# EAGLE design uc2950 (EAGLE 8.3.2)
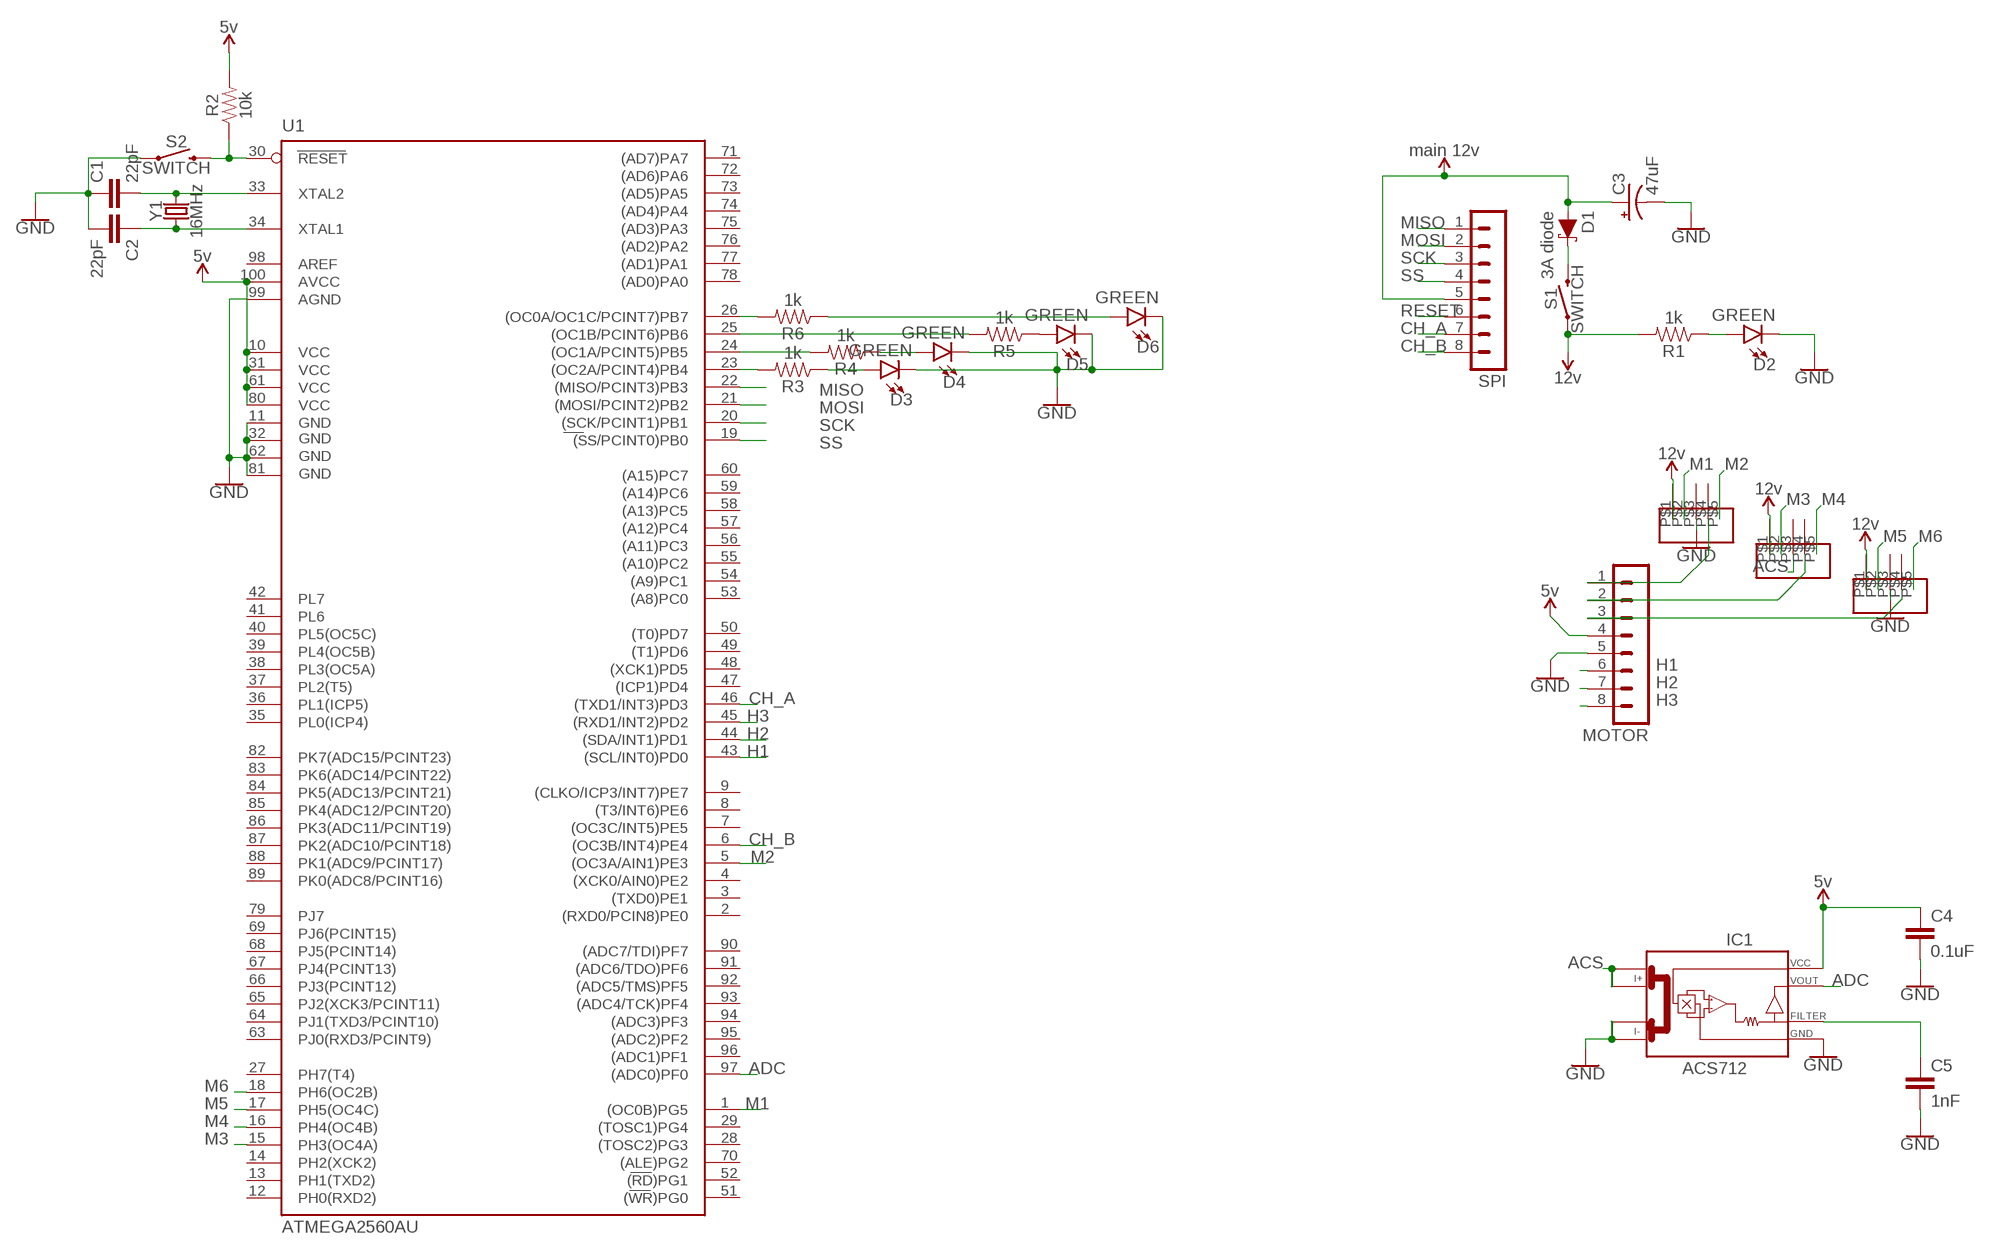
[diagram p0: schematic, sheet 1]

## Parts
C1  22pF  22PF-0603-50V-5%  [0603]
C2  22pF  22PF-0603-50V-5%  [0603]
C3  47uF  47UF-POLAR-EIA3528-10V-10%  [EIA3528]
C4  0.1uF  0.1UF-0603-25V-(+80/-20%)  [0603]
C5  1nF  1.0NF/1000PF-0603-50V-10%  [0603]
D1  3A diode  DIODE-SCHOTTKY-B340A  [SMA-DIODE]
D2  GREEN  LED-GREEN0603  [LED-0603]
D3  GREEN  LED-GREEN0603  [LED-0603]
D4  GREEN  LED-GREEN0603  [LED-0603]
D5  GREEN  LED-GREEN0603  [LED-0603]
D6  GREEN  LED-GREEN0603  [LED-0603]
IC1  ACS712  [SO08]
M1  M1  UC2950  [UC2950]
M2  M2  UC2950  [UC2950]
M3  M3  UC2950  [UC2950]
MOTOR  MA08-1  [MA08-1]
R1  1k  1KOHM-0603-1/10W-1%  [0603]
R2  10k  10KOHM-0603-1/10W-1%  [0603]
R3  1k  1KOHM-0603-1/10W-1%  [0603]
R4  1k  1KOHM-0603-1/10W-1%  [0603]
R5  1k  1KOHM-0603-1/10W-1%  [0603]
R6  1k  1KOHM-0603-1/10W-1%  [0603]
S1  SWITCH  MOMENTARY-SWITCH-SPST-SMD-4.6X2.8MM  [TACTILE_SWITCH_SMD_4.6X2.8MM]
S2  SWITCH  MOMENTARY-SWITCH-SPST-SMD-4.6X2.8MM  [TACTILE_SWITCH_SMD_4.6X2.8MM]
SPI  MA08-1  [MA08-1]
U1  ATMEGA2560AU  [TQFP100]
Y1  16MHz  CRYSTAL-16MHZSMD-5X3.2  [CRYSTAL-SMD-5X3.2-4PAD]

## Nets
ACS: IC1.1(I+_0) IC1.2(I+_1) M2.P$3
ADC: IC1.7(VOUT) U1.97((ADC0)PF0)
CH_A: SPI.7 U1.46((TXD1/INT3)PD3)
CH_B: SPI.8 U1.6((OC3B/INT4)PE4)
GND: C1.1 C2.2 C3.C(-) C4.2 C5.2 D2.C D3.C D4.C D5.C D6.C IC1.3(I-_0) IC1.4(I-_1) IC1.5(GND) M1.P$3 M3.P$3 MOTOR.5 S2.1 S2.2 U1.11(GND) U1.32(GND1) U1.62(GND2) U1.81(GND3) U1.99(AGND)
H1: MOTOR.6 U1.43((SCL/INT0)PD0)
H2: MOTOR.7 U1.44((SDA/INT1)PD1)
H3: MOTOR.8 U1.45((RXD1/INT2)PD2)
M1: M1.P$2 U1.1((OC0B)PG5)
M2: M1.P$5 U1.5((OC3A/AIN1)PE3)
M3: M2.P$2 U1.15(PH3(OC4A))
M4: M2.P$5 U1.16(PH4(OC4B))
M5: M3.P$2 U1.17(PH5(OC4C))
M6: M3.P$5 U1.18(PH6(OC2B))
MISO: SPI.1 U1.22((MISO/PCINT3)PB3)
MOSI: SPI.2 U1.21((MOSI/PCINT2)PB2)
N$1: D1.C S1.3 S1.4
N$3: D2.A R1.1
N$4: M1.P$4 MOTOR.1
N$5: M3.P$4 MOTOR.3
N$6: M2.P$4 MOTOR.2
N$10: C5.1 IC1.6(FILTER)
N$15: C1.2 U1.33(XTAL2) Y1.3
N$16: C2.1 U1.34(XTAL1) Y1.1
N$17: R4.2 U1.24((OC1A/PCINT5)PB5)
N$19: D3.A R3.1
N$20: D4.A R4.1
N$21: D5.A R5.1
N$22: D6.A R6.1
N$23: R3.2 U1.23((OC2A/PCINT4)PB4)
N$24: R5.2 U1.25((OC1B/PCINT6)PB6)
N$25: R6.2 U1.26((OC0A/OC1C/PCINT7)PB7)
RESET: R2.1 S2.3 S2.4 SPI.6 U1.30(RESET)
SCK: SPI.3 U1.20((SCK/PCINT1)PB1)
SS: SPI.4 U1.19((SS/PCINT0)PB0)
VCC_1: C3.A(+) D1.A SPI.5 ; supply symbol labelled main 12v
VCC_2: M1.P$1 M2.P$1 M3.P$1 R1.2 S1.1 S1.2 ; supply symbol labelled 12v
VCCIO: C4.1 IC1.8(VCC) MOTOR.4 R2.2 U1.10(VCC) U1.31(VCC1) U1.61(VCC2) U1.80(VCC3) U1.100(AVCC) ; supply symbol labelled 5v
Unconnected: U1.2((RXD0/PCIN8)PE0) U1.3((TXD0)PE1) U1.4((XCK0/AIN0)PE2) U1.7((OC3C/INT5)PE5) U1.8((T3/INT6)PE6) U1.9((CLKO/ICP3/INT7)PE7) U1.12(PH0(RXD2)) U1.13(PH1(TXD2)) U1.14(PH2(XCK2)) U1.27(PH7(T4)) U1.28((TOSC2)PG3) U1.29((TOSC1)PG4) U1.35(PL0(ICP4)) U1.36(PL1(ICP5)) U1.37(PL2(T5)) U1.38(PL3(OC5A)) U1.39(PL4(OC5B)) U1.40(PL5(OC5C)) U1.41(PL6) U1.42(PL7) U1.47((ICP1)PD4) U1.48((XCK1)PD5) U1.49((T1)PD6) U1.50((T0)PD7) U1.51((WR)PG0) U1.52((RD)PG1) U1.53((A8)PC0) U1.54((A9)PC1) U1.55((A10)PC2) U1.56((A11)PC3) U1.57((A12)PC4) U1.58((A13)PC5) U1.59((A14)PC6) U1.60((A15)PC7) U1.63(PJ0(RXD3/PCINT9)) U1.64(PJ1(TXD3/PCINT10)) U1.65(PJ2(XCK3/PCINT11)) U1.66(PJ3(PCINT12)) U1.67(PJ4(PCINT13)) U1.68(PJ5(PCINT14)) U1.69(PJ6(PCINT15)) U1.70((ALE)PG2) U1.71((AD7)PA7) U1.72((AD6)PA6) U1.73((AD5)PA5) U1.74((AD4)PA4) U1.75((AD3)PA3) U1.76((AD2)PA2) U1.77((AD1)PA1) U1.78((AD0)PA0) U1.79(PJ7) U1.82(PK7(ADC15/PCINT23)) U1.83(PK6(ADC14/PCINT22)) U1.84(PK5(ADC13/PCINT21)) U1.85(PK4(ADC12/PCINT20)) U1.86(PK3(ADC11/PCINT19)) U1.87(PK2(ADC10/PCINT18)) U1.88(PK1(ADC9/PCINT17)) U1.89(PK0(ADC8/PCINT16)) U1.90((ADC7/TDI)PF7) U1.91((ADC6/TDO)PF6) U1.92((ADC5/TMS)PF5) U1.93((ADC4/TCK)PF4) U1.94((ADC3)PF3) U1.95((ADC2)PF2) U1.96((ADC1)PF1) U1.98(AREF)

## Library data of the parts
C1 C2 = SparkFun-Capacitors:22PF: 22pF ceramic capacitors A capacitor is a passive two-terminal electrical component used to store electrical energy temporarily in an electric field.; PROD_ID: CAP-07876
C3 = SparkFun-Capacitors:47UF-POLAR: 47µF polarized capacitors A capacitor is a passive two-terminal electrical component used to store electrical energy temporarily in an electric field.; PROD_ID: CAP-08310
C4 = SparkFun-Capacitors:0.1UF: 0.1µF ceramic capacitors A capacitor is a passive two-terminal electrical component used to store electrical energy temporarily in an electric field.; PROD_ID: CAP-00810
C5 = SparkFun-Capacitors:1.0NF/1000PF: 1nF/1,000pF ceramic capacitors A capacitor is a passive two-terminal electrical component used to store electrical energy temporarily in an electric field.; PROD_ID: CAP-07886
D1 = SparkFun-DiscreteSemi:DIODE-SCHOTTKY: Schottky diode A Schottky diode is a semiconductor diode which has a low forward voltage drop and a very fast switching action.; PROD_ID: DIO-09886; VALUE: 3A/40V/500mV
D2-D6 = SparkFun-LED:LED-GREEN: Green SMD LED Used in manufacturing of various products at SparkFun Packages: 0603 - SMD 0603 package [Product Link] <http://www.futureelectronics.com/en/technologies/semiconductors/optoelectronics/leds/Pages/9894312-LTST-C190GKT.aspx?CrossPart=HSMG-C190&IM=0> LilyPad 1206 - SMD1206 LilyPad package [Product Link] <http://www.futureelectronics.com/en/Technologies/Product.aspx?ProductID=IN150NGHARVATEKCORPORATION2049943&IM=0> 1206 - SMD1206 package [Product Link] <http://www.futureelectronics.com/en/technologies/semiconductors/optoelectronics/leds/Pages/8315665-LTST-C150KGKT.aspx?IM=0> 1206 Bottom Mount -SMD 1206 Bottom Mount [Product Link] <http://www.digikey.com/product-detail/en/lite-on-inc/LTST-C230KGKT/160-1456-1-ND/386854> SparkFun Products: Pro Mini 328 -5V <https://www.sparkfun.com/products/821> RedBoard <https://www.sparkfun.com/products/12757> MP3 Trigger <https://www.sparkfun.com/products/13720> Makey Makey <https://www.sparkfun.com/products/11076>; PROD_ID: DIO-00821
IC1 = ACS712:ACS712
M1-M3 = uc2950:UC2950: UC2950T Motor Driver IC
MOTOR SPI = con-lstb:MA08-1: PIN HEADER; OC_FARNELL: unknown; OC_NEWARK: unknown
R1 R3-R6 = SparkFun-Resistors:1KOHM: 1kΩ resistor A resistor is a passive two-terminal electrical component that implements electrical resistance as a circuit element. Resistors act to reduce current flow, and, at the same time, act to lower voltage levels within circuits. - Wikipedia; PROD_ID: RES-07856
R2 = SparkFun-Resistors:10KOHM: 10kΩ resistor A resistor is a passive two-terminal electrical component that implements electrical resistance as a circuit element. Resistors act to reduce current flow, and, at the same time, act to lower voltage levels within circuits. - Wikipedia; PROD_ID: RES-00824
S1 S2 = SparkFun-Switches:MOMENTARY-SWITCH-SPST: Momentary Switch (Pushbutton) - SPST Normally-open (NO) SPST momentary switches (buttons, pushbuttons). Variants PTH-12MM - 12mm square, through-hole Momentary Pushbutton Switch - 12mm Square <https://www.sparkfun.com/products/9190> (COM-09190) PTH-6.0MM, PTH-6.0MM-KIT - 6.0mm square, through-hole Mini Pushbutton Switch <https://www.sparkfun.com/products/97> (COM-00097) KIT package intended for soldering kit's - only one side of pads' copper is exposed. PTH-RIGHT-ANGLE-KIT - Right-angle, through-hole Right Angle Tactile Button <https://www.sparkfun.com/products/10791> - Used on SparkFun BigTime Watch Kit <https://www.sparkfun.com/products/11734> SMD-12MM - 12mm square, surface-mount Tactile Button - SMD (12mm) <https://www.sparkfun.com/products/12993> (COM-12993) Used on SparkFun PicoBoard <https://www.sparkfun.com/products/11888> SMD-4.5MM - 4.5mm Square Trackball Switch Used on SparkFun Blackberry Trackballer Breakout <https://www.sparkfun.com/products/13169> SMD-4.6MMX2.8MM - 4.60mm x 2.80mm, surface mount Used on SparkFun SAMD21 Mini Breakout <https://www.sparkfun.com/products/13664> SMD-5.2MM, SMD-5.2-REDUNDANT - 5.2mm square, surface-mount Mini Pushbutton Switch - SMD <https://www.sparkfun.com/products/8720> (COM-08720) Used on Arduino Pro Mini <https://www.sparkfun.com/products/11114> REDUNDANT package connects both switch circuits together SMD-6.0X3.5MM - 6.0 x 3.5mm, surface mount Momentary Reset Switch SMD <https://www.sparkfun.com/products/8229> (COM-08229) SMD-6.2MM-TALL - 6.2mm square, surface mount Tactile Button - SMD (6mm) <https://www.sparkfun.com/products/12992> Used on SparkFun Digital Sandbox <https://www.sparkfun.com/products/12651> SMD-RIGHT-ANGLE - Right-angle, surface mount Used on SparkFun Block for Intel® Edison - Arduino <https://www.sparkfun.com/products/13036>; PROD_ID: SWCH-13065
U1 = SparkFun-IC-Microcontroller:ATMEGA2560: Atmel 100-pin 8-bit uC 64/128/256 Kbytes FLASH 4 Kbytes EEPROM 8 Kbytes SRAM 86 General Purpose I/O pins 12-channels16-bit PWM 4 x Serial USARTs 16-channels 10-bit A/D SparkFun Products None.; PROD_ID: IC-10040
Y1 = SparkFun-Clocks:CRYSTAL-16MHZ: 16MHz Crystal Digikey Example <http://www.digikey.com/product-search/en?keywords=535-9122-1-ND> Frequency: 16MHz Frequency Stability: ±50ppm Frequency Tolerance: ±20ppm Load Capacitance: 18pF SparkFun Products: Pro Micro -5V/16MHz <https://www.sparkfun.com/products/12640> SparkFun Serial Enabled LCD Kit <https://www.sparkfun.com/products/10097>; PROD_ID: XTAL-08218; SF_ID: COM-00094

## Board
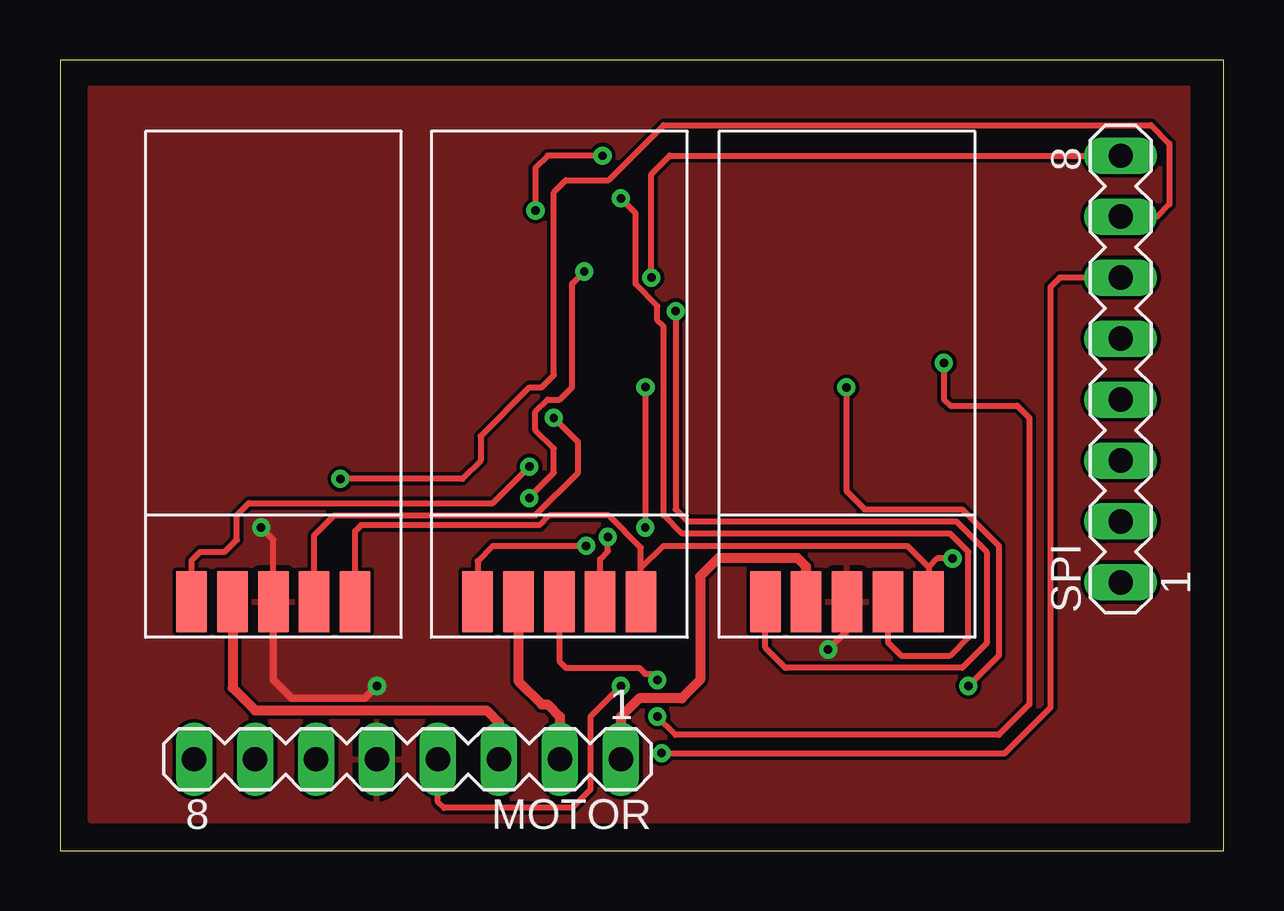
[diagram p1: board, top side]
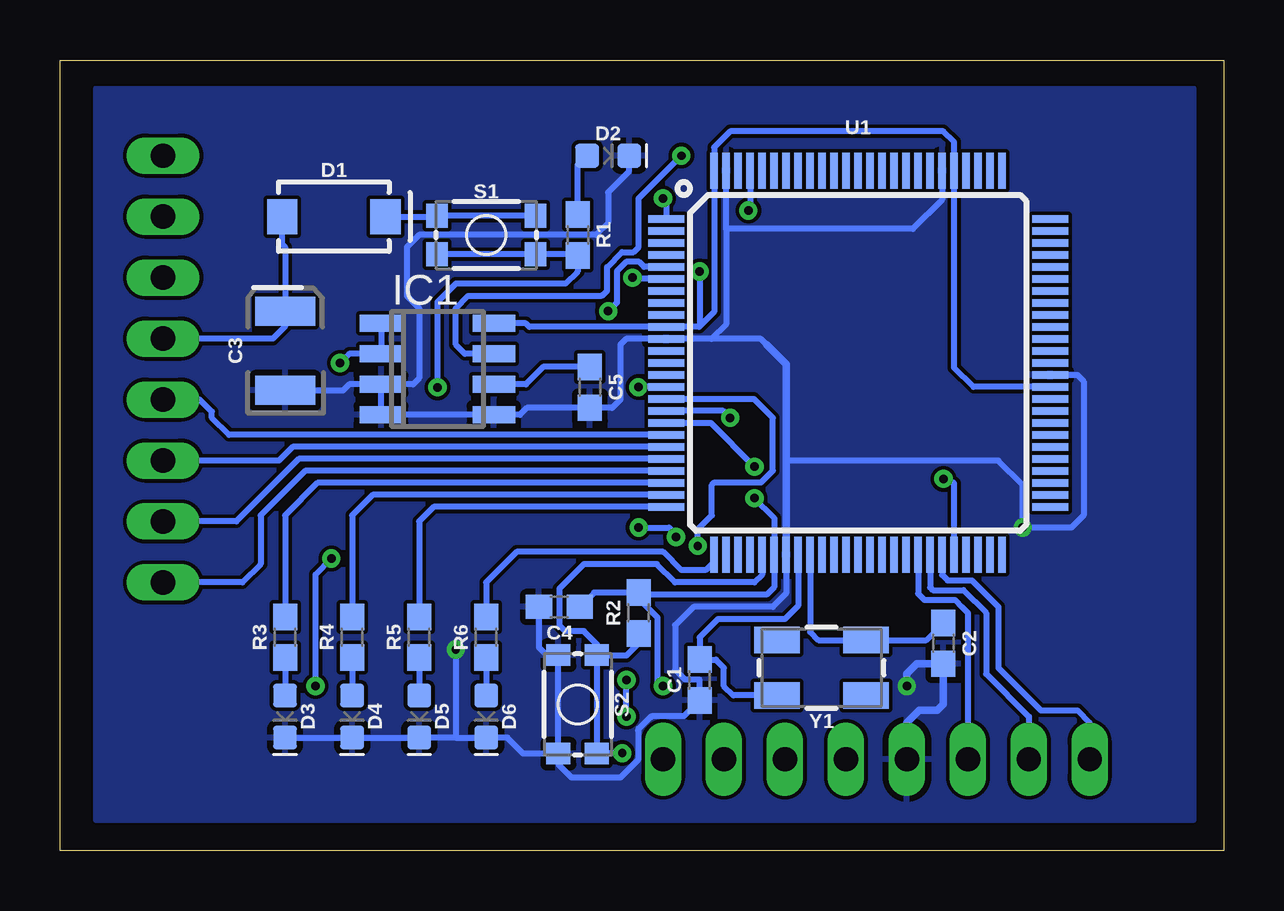
[diagram p2: board, bottom side, seen from below]

Size 48.49 x 32.94 mm. Coordinates in mm from the lower left corner, seen from the top.
Outline: 0,0 48.49,0 48.49,32.94 0,32.94 0,0
Copper layers (1*16): Top 0.035mm / dielectric 1.5mm / Bottom 0.035mm
Design rules "default": minimum track width 6mil, minimum drill 0.35mm, track to track 6mil, track to pad 6mil, pad to pad 6mil, via to via 6mil, smd to smd 6mil, copper to edge 40mil, drill to drill 6mil, minimum pad ring 10mil, minimum via ring 8mil, stop-mask expansion 4mil, vias tented up to drill 0mil, thermal gap 10mil

### Footprints (pad centres in the part's own frame; a part is rotated, then mirrored left to right if it is on the bottom)
0603 = smd 1.1 x 1: 1 -0.85,0; 2 0.85,0
EIA3528 = smd 1.2 x 2.5: A 1.65,0; C -1.65,0
SMA-DIODE = smd 1.27 x 1.47: A -2.15,0; C 2.15,0
LED-0603 = smd 1 x 1: A -0.877,0; C 0.877,0
SO08 = smd 0.72 x 1.78: 1 -1.905,-2.35; 2 -0.635,-2.35; 3 0.635,-2.35; 4 1.905,-2.35; 5 1.905,2.35; 6 0.635,2.35; 7 -0.635,2.35; 8 -1.905,2.35
UC2950 = smd 1.27 x 2.54: P$1 1.93,3.607; P$2 3.632,3.607; P$3 5.334,3.607; P$4 7.036,3.607; P$5 8.738,3.607
MA08-1 = drill 1.016 long: 1 -8.89,0; 2 -6.35,0; 3 -3.81,0; 4 -1.27,0; 5 1.27,0; 6 3.81,0; 7 6.35,0; 8 8.89,0
TACTILE_SWITCH_SMD_4.6X2.8MM = smd 0.9 x 1: 1 -2.05,-0.8; 2 2.05,-0.8; 3 2.05,0.8; 4 -2.05,0.8
TQFP100 = smd 1.5 x 0.3: 1 -8,6; 2 -8,5.5; 3 -8,5; 4 -8,4.5; 5 -8,4; 6 -8,3.5; 7 -8,3; 8 -8,2.5; 9 -8,2; 10 -8,1.5; 11 -8,1; 12 -8,0.5; 13 -8,0; 14 -8,-0.5; 15 -8,-1; 16 -8,-1.5; 17 -8,-2; 18 -8,-2.5; 19 -8,-3; 20 -8,-3.5; 21 -8,-4; 22 -8,-4.5; 23 -8,-5; 24 -8,-5.5; 25 -8,-6; 51 8,-6; 52 8,-5.5; 53 8,-5; 54 8,-4.5; 55 8,-4; 56 8,-3.5; 57 8,-3; 58 8,-2.5; 59 8,-2; 60 8,-1.5; 61 8,-1; 62 8,-0.5; 63 8,0; 64 8,0.5; 65 8,1; 66 8,1.5; 67 8,2; 68 8,2.5; 69 8,3; 70 8,3.5; 71 8,4; 72 8,4.5; 73 8,5; 74 8,5.5; 75 8,6 | smd 0.3 x 1.5: 26 -6,-8; 27 -5.5,-8; 28 -5,-8; 29 -4.5,-8; 30 -4,-8; 31 -3.5,-8; 32 -3,-8; 33 -2.5,-8; 34 -2,-8; 35 -1.5,-8; 36 -1,-8; 37 -0.5,-8; 38 0,-8; 39 0.5,-8; 40 1,-8; 41 1.5,-8; 42 2,-8; 43 2.5,-8; 44 3,-8; 45 3.5,-8; 46 4,-8; 47 4.5,-8; 48 5,-8; 49 5.5,-8; 50 6,-8; 76 6,8; 77 5.5,8; 78 5,8; 79 4.5,8; 80 4,8; 81 3.5,8; 82 3,8; 83 2.5,8; 84 2,8; 85 1.5,8; 86 1,8; 87 0.5,8; 88 0,8; 89 -0.5,8; 90 -1,8; 91 -1.5,8; 92 -2,8; 93 -2.5,8; 94 -3,8; 95 -3.5,8; 96 -4,8; 97 -4.5,8; 98 -5,8; 99 -5.5,8; 100 -6,8
CRYSTAL-SMD-5X3.2-4PAD = smd 1.9 x 1.1: 1 -1.85,-1.15; 2 1.85,-1.15; 3 1.85,1.15; 4 -1.85,1.15

### Placement (x,y rotation side)
C1  21.84,7.11 90 bottom
C2  11.68,8.64 270 bottom
C3  39.12,20.83 90 bottom
C4  27.69,10.16 180 bottom
C5  26.42,19.3 270 bottom
D1  37.08,26.42 0 bottom
D2  25.65,28.96 0 bottom
D3  39.12,5.59 270 bottom
D4  36.32,5.59 270 bottom
D5  33.53,5.59 270 bottom
D6  30.73,5.59 270 bottom
IC1  32.77,20.07 270 bottom
M1  38.13,13.97 180 top
M2  26.14,13.97 180 top
M3  14.22,13.97 180 top
MOTOR  14.48,3.81 180 top
R1  26.92,25.65 270 bottom
R2  24.38,9.91 90 bottom
R3  39.12,8.89 90 bottom
R4  36.32,8.89 90 bottom
R5  33.53,8.89 90 bottom
R6  30.73,8.89 90 bottom
S1  30.73,25.65 0 bottom
S2  26.92,6.1 270 bottom
SPI  44.2,20.07 90 top
U1  15.24,20.32 0 bottom
Y1  16.76,7.62 180 bottom

### Tracks (layer width: path | path; a pad name or v marks a point on that pad's centre or on a via)
ACS  (via drill 0.35)
  Top 0.254: M2.P$3 20.8,7.9 21.08,7.62 24.13,7.62 24.38,7.37 24.64,7.37 v24.89,7.11 | v36.83,20.32 36.83,18.8 37.08,18.54 39.88,18.54 40.39,18.03 40.39,6.1 39.12,4.83 25.65,4.83 v24.89,5.59
  Bottom 0.254: IC1.1 IC1.2 36.45,20.7 v36.83,20.32 | v24.89,5.59 v24.89,7.11
ADC  (via drill 0.35)
  Top 0.254: v22.61,28.96 20.32,28.96 19.81,28.45 v19.81,26.67
  Bottom 0.254: IC1.7 31.62,20.7 32,21.08 32,22.61 31.5,23.11 25.95,23.11 25.93,23.14 25.89,23.14 25.7,23.32 25.7,24.32 25.08,24.94 24.59,24.94 24.38,25.15 24.38,27.18 v22.61,28.96 | U1.97 19.74,26.74 v19.81,26.67
CH_A  (via drill 0.35)
  Top 0.254: SPI.7 45.72,26.42 46.23,26.92 46.23,29.46 45.47,30.23 25.15,30.23 22.86,27.94 21.08,27.94 20.57,27.43 20.57,19.81 20.07,19.3 19.56,19.3 17.53,17.27 17.53,16.26 16.76,15.49 v11.68,15.49
  Bottom 0.254: U1.46 11.24,15.3 v11.68,15.49
CH_B  (via drill 0.35)
  Top 0.254: v24.64,23.88 24.64,28.19 25.4,28.96 SPI.8
  Bottom 0.254: U1.6 24.58,23.82 v24.64,23.88
GND  (via drill 0.35)
  Top 0.254: M3.P$3 8.89,12.95 v8.38,13.46 | M1.P$3 32.79,9.17 v32,8.38
  Top 0.305: M3.P$3 8.89,7.11 9.65,6.35 12.7,6.35 v13.21,6.86
  Bottom 0.254: IC1.3 IC1.4 IC1.5 29.34,18.16 29.04,18.45 C5.2 25.49,18.45 25.15,18.8 25.15,21.08 24.91,21.32 U1.11 | D3.C D4.C D5.C 32,4.71 | 32,4.71 D6.C 29.86,4.71 29.19,4.05 S2.2 | C3.C 36.7,19.18 36.45,19.43 IC1.3 | S2.2 S2.1 28.21,8.15 28.54,8.47 C4.2 | 20.74,25.91 U1.99 | 20.74,25.91 20.74,21.93 21.35,21.32 U1.11 | U1.81 11.74,27.12 12.95,25.91 20.74,25.91 | 19.05,21.08 19.29,21.32 U1.11 | U1.62 6.1,19.82 5.84,19.56 5.84,13.97 6.35,13.46 v8.38,13.46 8.38,15.24 9.4,16.26 18.24,16.26 | IC1.3 33.78,19.43 33.53,19.68 33.53,22.61 34.04,23.11 34.04,25.15 33.53,25.65 26.16,25.65 25.65,26.16 25.65,27.43 24.78,28.31 D2.C | v32,8.38 32,4.71 | S2.2 27.72,3.59 27.18,3.05 25.15,3.05 24.41,3.79 24.41,5 24.38,5.03 24.38,5.08 23.88,5.59 23.82,5.59 23.8,5.61 22.49,5.61 C1.1 21.84,7.11 21.86,7.13 22.46,7.13 22.86,7.53 22.86,9.4 22.1,10.16 18.8,10.16 18.24,10.72 U1.32
  Bottom 0.305: MOTOR.5 13.21,5.33 12.7,5.84 11.94,5.84 11.68,6.1 C2.2 12.79,7.79 13.21,7.37 v13.21,6.86 | U1.32 18.24,16.26 18.24,20.27 19.05,21.08
  pour Top: 1.27,1.27 46.99,1.27 46.99,31.75 1.27,31.75
  pour Bottom: 1.27,1.27 46.99,1.27 46.99,31.75 1.27,31.75
H1
  Bottom 0.254: U1.43 12.74,10.71 12.48,10.45 11.2,10.45 10.9,10.15 10.9,10.14 10.67,9.91 MOTOR.6
H2
  Bottom 0.254: U1.44 12.24,10.97 12.12,10.85 10.85,10.85 9.91,9.91 9.91,7.37 8.13,5.59 MOTOR.7
H3
  Bottom 0.254: U1.45 11.74,11.49 11.51,11.26 10.5,11.26 9.4,10.16 9.4,7.62 7.62,5.84 6.1,5.84 5.59,5.33 MOTOR.8
M1  (via drill 0.35)
  Top 0.254: M1.P$2 34.49,8.69 35.05,8.13 37.08,8.13 37.85,8.89 37.85,12.45 37.08,13.21 25.91,13.21 25.15,13.97 25.15,21.84 24.89,22.1 24.89,22.69 23.98,23.6 23.98,26.57 v23.37,27.18
  Bottom 0.254: 23.24,27.18 23.24,27.3 | 23.24,27.18 U1.1 | v23.37,27.18 23.24,27.18
M2  (via drill 0.35)
  Top 0.254: v25.65,22.48 25.65,14.22 26.16,13.72 37.34,13.72 38.61,12.45 38.61,8.64 37.59,7.62 30.23,7.62 29.39,8.46 M1.P$5
  Bottom 0.254: U1.5 24.15,24.32 24.37,24.53 24.91,24.53 25.3,24.15 25.3,22.84 v25.65,22.48
M3  (via drill 0.35)
  Top 0.254: v24.38,13.46 24.39,13.47 v24.39,19.32 | v22.83,13.07 22.83,12.48 22.5,12.15 M2.P$2
  Bottom 0.254: U1.15 v24.39,19.32 | v24.38,13.46 23.11,13.46 22.86,13.21 22.86,13.1 v22.83,13.07
M4  (via drill 0.35)
  Top 0.254: M2.P$5 17.4,12.06 18.03,12.7 v21.92,12.7
  Bottom 0.254: U1.16 19.58,18.82 18.8,18.03 18.8,15.83 19.29,15.34 21.23,15.34 21.34,15.24 21.34,13.97 21.92,13.38 v21.92,12.7
M5  (via drill 0.35)
  Top 0.254: M3.P$2 10.59,13.13 11.43,13.97 19.81,13.97 21.59,15.75 21.59,17.02 v20.57,18.03
  Bottom 0.254: U1.17 20.86,18.32 v20.57,18.03
M6  (via drill 0.35)
  Top 0.254: M3.P$5 5.49,12.09 5.84,12.45 6.86,12.45 7.37,12.95 7.37,13.97 7.87,14.48 18.03,14.48 v19.56,16
  Bottom 0.254: U1.18 21.38,17.82 v19.56,16
MISO
  Bottom 0.254: U1.22 38.28,15.82 40.13,13.97 40.13,11.94 40.89,11.18 SPI.1
MOSI
  Bottom 0.254: U1.21 38.54,16.32 41.15,13.72 SPI.2
N$1
  Bottom 0.254: D1.C 32.82,26.42 S1.4 S1.3
N$3
  Bottom 0.254: R1.1 26.92,28.56 D2.A
N$4
  Top 0.406: M1.P$4 31.09,11.84 30.73,12.19 27.43,12.19 26.67,11.43 26.67,7.11 25.91,6.35 24.13,6.35 23.37,5.59 MOTOR.1
N$5
  Top 0.406: M3.P$4 7.19,6.78 8.13,5.84 17.78,5.84 18.29,5.33 MOTOR.3
N$6
  Top 0.406: M2.P$4 19.1,7.06 20.07,6.1 20.32,6.1 20.83,5.59 MOTOR.2
N$10
  Bottom 0.254: C5.1 28.36,20.15 29.08,19.43 IC1.6
N$15
  Bottom 0.254: Y1.3 20.44,6.47 20.83,6.86 20.83,7.62 21.17,7.96 C1.2 21.84,8.89 21.08,9.65 18.29,9.65 17.74,10.2 U1.33
N$16
  Bottom 0.254: U1.34 17.24,9.11 16.9,8.77 Y1.1 12.4,8.77 C2.1
N$17
  Bottom 0.254: U1.24 35.47,14.82 36.32,13.97 R4.2
N$19
  Bottom 0.254: R3.1 D3.A
N$20
  Bottom 0.254: R4.1 D4.A
N$21
  Bottom 0.254: R5.1 D5.A
N$22
  Bottom 0.254: R6.1 D6.A
N$23
  Bottom 0.254: U1.23 37.77,15.32 39.12,13.97 R3.2
N$24
  Bottom 0.254: U1.25 32.92,14.32 33.53,13.72 R5.2
N$25
  Bottom 0.254: R6.2 30.73,11.18 29.46,12.45 23.37,12.45 22.61,11.68 21.59,11.68 21.24,12.03 U1.26
RESET  (via drill 0.35)
  Top 0.254: SPI.6 41.66,23.88 41.27,23.5 41.27,5.97 39.37,4.06 v25.07,4.06
  Bottom 0.254: 26.12,8.13 S2.3 26.11,4.06 v25.07,4.06 | 26.12,8.13 S2.4 26.12,8.6 26.67,9.14 27.43,9.14 27.69,9.4 27.69,10.92 26.67,11.94 23.62,11.94 22.86,11.18 19.56,11.18 19.24,11.49 U1.30 | R2.1 24.38,8.64 24.89,8.13 26.12,8.13
SCK
  Bottom 0.254: U1.20 38.81,16.82 39.37,16.26 SPI.3
SS
  Bottom 0.254: U1.19 41.45,17.32 42.16,18.03 42.16,18.29 42.67,18.8 SPI.4
VCC_1
  Bottom 0.254: D1.A 39.23,25.26 39.12,25.15 C3.A 39.12,21.84 39.62,21.34 SPI.5
VCC_2  (via drill 0.35)
  Top 0.254: 36.2,11.81 M1.P$1 | M2.P$1 24.21,11.76 | M3.P$1 12.29,13.31 12.55,13.56 19.98,13.56 20.39,13.97 22.86,13.97 24.21,12.62 24.21,11.76 | v32.77,19.3 32.77,14.99 33.53,14.22 37.59,14.22 39.12,12.7 39.12,8.13 v37.85,6.86 | v37.19,12.17 36.56,12.17 36.2,11.81 | 24.21,11.76 25.15,12.7 35.31,12.7 36.2,11.81
  Bottom 0.254: S1.1 S1.2 26.97,24.85 R1.2 | 26.72,24.85 R1.2 | R1.2 26.92,24.13 27.43,23.62 32,23.62 32.77,22.86 v32.77,19.3 | v37.85,6.86 37.85,11.52 v37.19,12.17
VCCIO  (via drill 0.35)
  Top 0.254: v23.37,6.86 22.1,5.59 22.1,2.54 21.34,1.78 16,1.78 15.75,2.03 MOTOR.4 | v19.56,14.69 19.56,14.73 20.57,15.75 20.57,16.76 19.81,17.53 19.81,18.29 20.32,18.8 20.83,18.8 21.34,19.3 21.34,23.62 v21.84,24.13
  Bottom 0.254: 21.84,21.84 21.24,22.45 U1.100 21.24,29.31 20.57,29.97 11.68,29.97 11.24,29.53 U1.80 11.24,20.13 10.43,19.32 U1.61 | IC1.8 29.08,21.97 28.93,21.82 U1.10 21.87,21.82 21.84,21.84 | R2.2 26.24,10.76 C4.1 | 24.22,10.92 R2.2 | R2.2 24.38,10.5 23.61,9.72 23.61,7.09 v23.37,6.86 | v19.56,14.69 18.74,13.87 U1.31 18.74,10.98 19.05,10.67 24.3,10.67 R2.2 | v21.84,24.13 21.84,21.84